# EAGLE design osc (EAGLE 5.11)

## Sheet 1 of 2
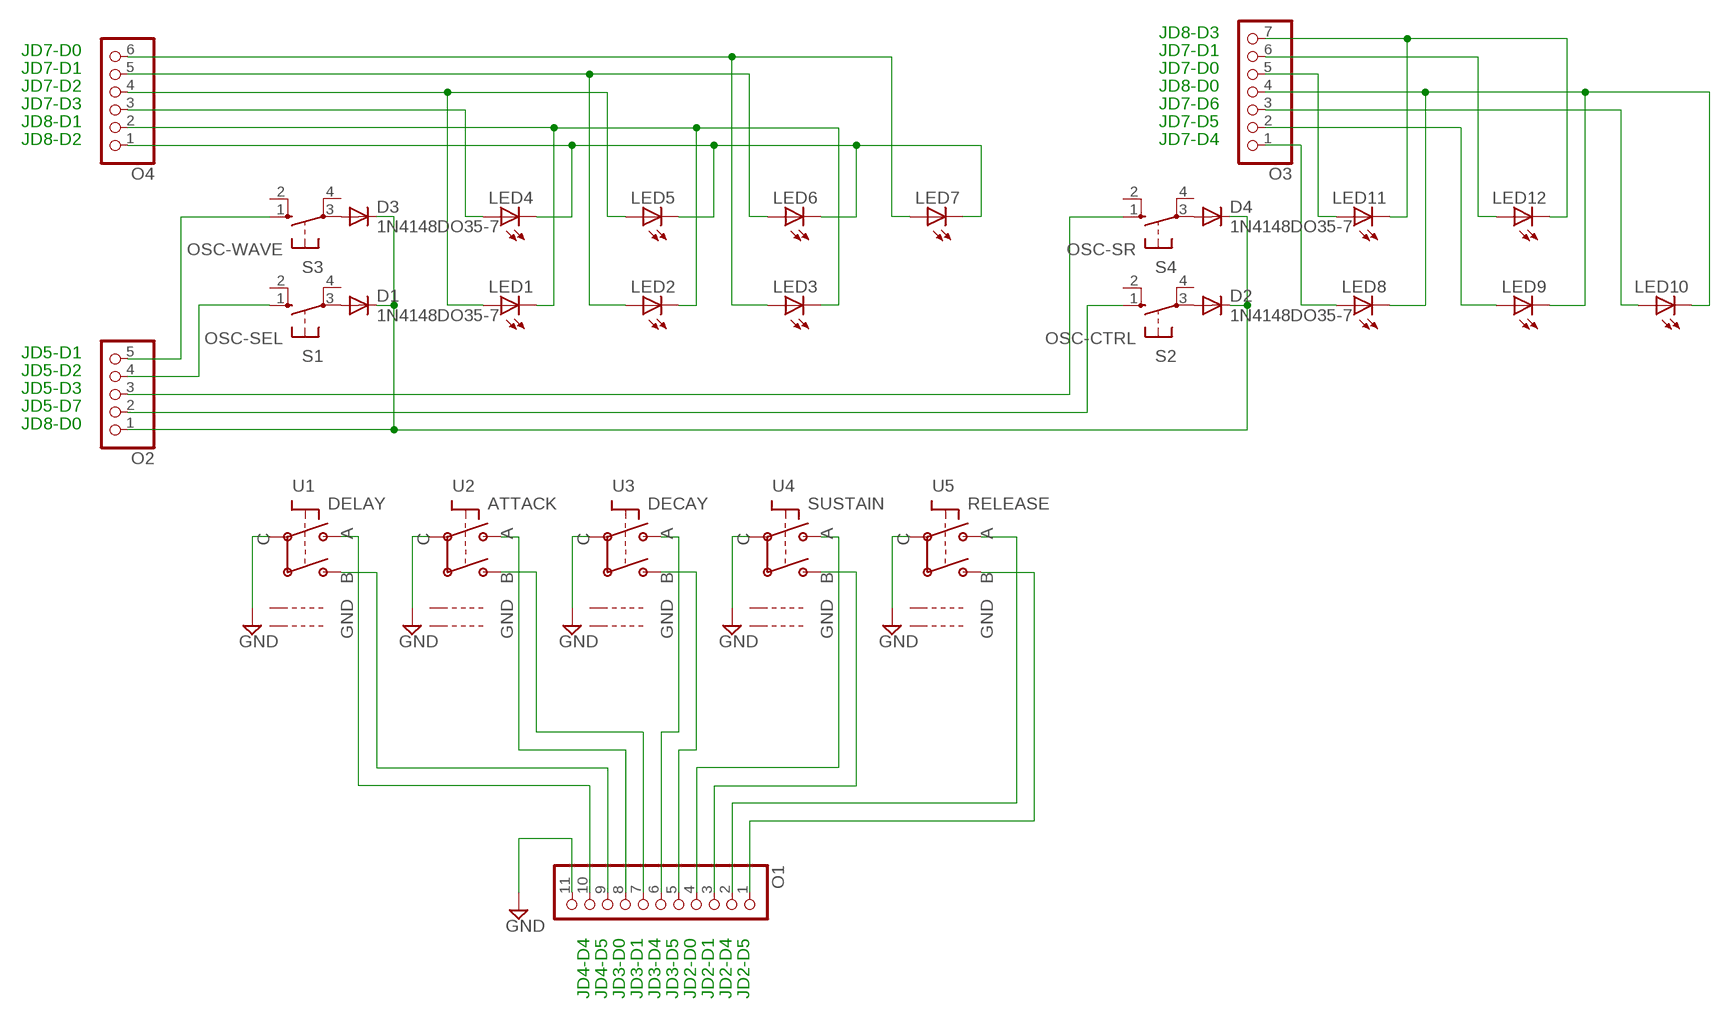
[diagram p0: schematic, sheet 1]

### Parts
D1  1N4148DO35-7  [DO35-7]
D2  1N4148DO35-7  [DO35-7]
D3  1N4148DO35-7  [DO35-7]
D4  1N4148DO35-7  [DO35-7]
LED1  LED3MM  [LED3MM]
LED2  LED3MM  [LED3MM]
LED3  LED3MM  [LED3MM]
LED4  LED3MM  [LED3MM]
LED5  LED3MM  [LED3MM]
LED6  LED3MM  [LED3MM]
LED7  LED3MM  [LED3MM]
LED8  LED3MM  [LED3MM]
LED9  LED3MM  [LED3MM]
LED10  LED3MM  [LED3MM]
LED11  LED3MM  [LED3MM]
LED12  LED3MM  [LED3MM]
O1  PINHD-1X11  [1X11]
O2  PINHD-1X5  [1X05]
O3  PINHD-1X7  [1X07]
O4  PINHD-1X6  [1X06]
S1  OSC-SEL  10-XX  [B3F-10XX]
S2  OSC-CTRL  10-XX  [B3F-10XX]
S3  OSC-WAVE  10-XX  [B3F-10XX]
S4  OSC-SR  10-XX  [B3F-10XX]
U1  DELAY  ENC_ALPS_STEC16  [STEC16]
U2  ATTACK  ENC_ALPS_STEC16  [STEC16]
U3  DECAY  ENC_ALPS_STEC16  [STEC16]
U4  SUSTAIN  ENC_ALPS_STEC16  [STEC16]
U5  RELEASE  ENC_ALPS_STEC16  [STEC16]

### Nets
GND: O1.11 U1.P$C U2.P$C U3.P$C U4.P$C U5.P$C
N$1: O1.10 U1.P$A
N$2: O1.9 U1.P$B
N$3: D3.A S3.3(P)
N$4: O1.8 U2.P$A
N$5: O1.7 U2.P$B
N$6: O1.6 U3.P$A
N$7: O1.5 U3.P$B
N$8: LED11.A O3.5
N$9: O1.4 U4.P$A
N$10: O1.3 U4.P$B
N$11: D1.A S1.3(P)
N$12: D2.A S2.3(P)
N$13: O2.4 S1.1(S)
N$14: O1.2 U5.P$A
N$15: O2.2 S2.1(S)
N$16: D1.C D2.C D3.C D4.C O2.1
N$17: O1.1 U5.P$B
N$18: D4.A S4.3(P)
N$19: LED12.A O3.6
N$20: LED11.K(C) LED12.K(C) O3.7
N$21: LED8.A O3.1
N$22: LED9.A O3.2
N$23: LED10.A O3.3
N$24: O2.5 S3.1(S)
N$25: LED8.K(C) LED9.K(C) LED10.K(C) O3.4
N$26: O2.3 S4.1(S)
N$27: LED1.K(C) LED2.K(C) LED3.K(C) O4.2
N$28: LED2.A LED6.A O4.5
N$30: LED4.K(C) LED5.K(C) LED6.K(C) LED7.K(C) O4.1
N$35: LED4.A O4.3
N$37: LED3.A LED7.A O4.6
N$38: LED1.A LED5.A O4.4
Unconnected: S1.2(S1) S1.4(P1) S2.2(S1) S2.4(P1) S3.2(S1) S3.4(P1) S4.2(S1) S4.4(P1) U1.P$GND1 U1.P$GND2 U2.P$GND1 U2.P$GND2 U3.P$GND1 U3.P$GND2 U4.P$GND1 U4.P$GND2 U5.P$GND1 U5.P$GND2

### Notes on the sheet
- JD8-D3
- JD7-D0 | JD7-D1
- JD7-D1 | JD7-D0
- JD7-D2 | JD8-D0
- JD7-D3 | JD7-D6
- JD8-D1 | JD7-D5
- JD8-D2 | JD7-D4
- JD5-D1
- JD5-D2
- JD5-D3
- JD5-D7
- JD8-D0
- JD4-D4 | JD4-D5 | JD3-D0 | JD3-D1 | JD3-D4 | JD3-D5 | JD2-D0 | JD2-D1 | JD2-D4 | JD2-D5

## Sheet 2 of 2

## Library data of the parts
D1-D4 = diode:1N4148: DIODE high speed (Philips)
LED1-LED12 = led:LED: LED OSRAM: - CHIPLED LG R971, LG N971, LY N971, LG Q971, LY Q971, LO R971, LY R971 LH N974, LH R974 LS Q976, LO Q976, LY Q976 LO Q996 - Hyper CHIPLED LW Q18S LB Q993, LB Q99A, LB R99A - SideLED LS A670, LO A670, LY A670, LG A670, LP A670 LB A673, LV A673, LT A673, LW A673 LH A674 LY A675 LS A676, LA A676, LO A676, LY A676, LW A676 LS A679, LY A679, LG A679 - Hyper Micro SIDELED® LS Y876, LA Y876, LO Y876, LY Y876 LT Y87S - SmartLED LW L88C, LW L88S LB L89C, LB L89S, LG L890 LS L89K, LO L89K, LY L89K LS L896, LA L896, LO L896, LY L896 - TOPLED LS T670, LO T670, LY T670, LG T670, LP T670 LSG T670, LSP T670, LSY T670, LOP T670, LYG T670 LG T671, LOG T671, LSG T671 LB T673, LV T673, LT T673, LW T673 LH T674 LS T676, LA T676, LO T676, LY T676, LB T676, LH T676, LSB T676, LW T676 LB T67C, LV T67C, LT T67C, LS T67K, LO T67K, LY T67K, LW E67C LS E67B, LA E67B, LO E67B, LY E67B, LB E67C, LV E67C, LT E67C LW T67C LS T679, LY T679, LG T679 LS T770, LO T770, LY T770, LG T770, LP T770 LB T773, LV T773, LT T773, LW T773 LH T774 LS E675, LA E675, LY E675, LS T675 LS T776, LA T776, LO T776, LY T776, LB T776 LHGB T686 LT T68C, LB T68C - Hyper Mini TOPLED® LB M676 - Mini TOPLED Santana® LG M470 LS M47K, LO M47K, LY M47K Source: http://www.osram.convergy.de LUXEON: - LUMILED® LXK2-PW12-R00, LXK2-PW12-S00, LXK2-PW14-U00, LXK2-PW14-V00 LXK2-PM12-R00, LXK2-PM12-S00, LXK2-PM14-U00 LXK2-PE12-Q00, LXK2-PE12-R00, LXK2-PE12-S00, LXK2-PE14-T00, LXK2-PE14-U00 LXK2-PB12-K00, LXK2-PB12-L00, LXK2-PB12-M00, LXK2-PB14-N00, LXK2-PB14-P00, LXK2-PB14-Q00 LXK2-PR12-L00, LXK2-PR12-M00, LXK2-PR14-Q00, LXK2-PR14-R00 LXK2-PD12-Q00, LXK2-PD12-R00, LXK2-PD12-S00 LXK2-PH12-R00, LXK2-PH12-S00 LXK2-PL12-P00, LXK2-PL12-Q00, LXK2-PL12-R00 Source: www.luxeon.com KINGBRIGHT: KA-3528ASYC Source: www.kingbright.com
O1 = pinhead:PINHD-1X11: PIN HEADER
O2 = pinhead:PINHD-1X5: PIN HEADER
O3 = pinhead:PINHD-1X7: PIN HEADER
O4 = pinhead:PINHD-1X6: PIN HEADER
S1-S4 = switch-omron:10-XX: OMRON SWITCH; MPN: B3F-1000; OC_FARNELL: 176432; OC_NEWARK: 36M3542
U1-U5 = encoder:ENC

## Board
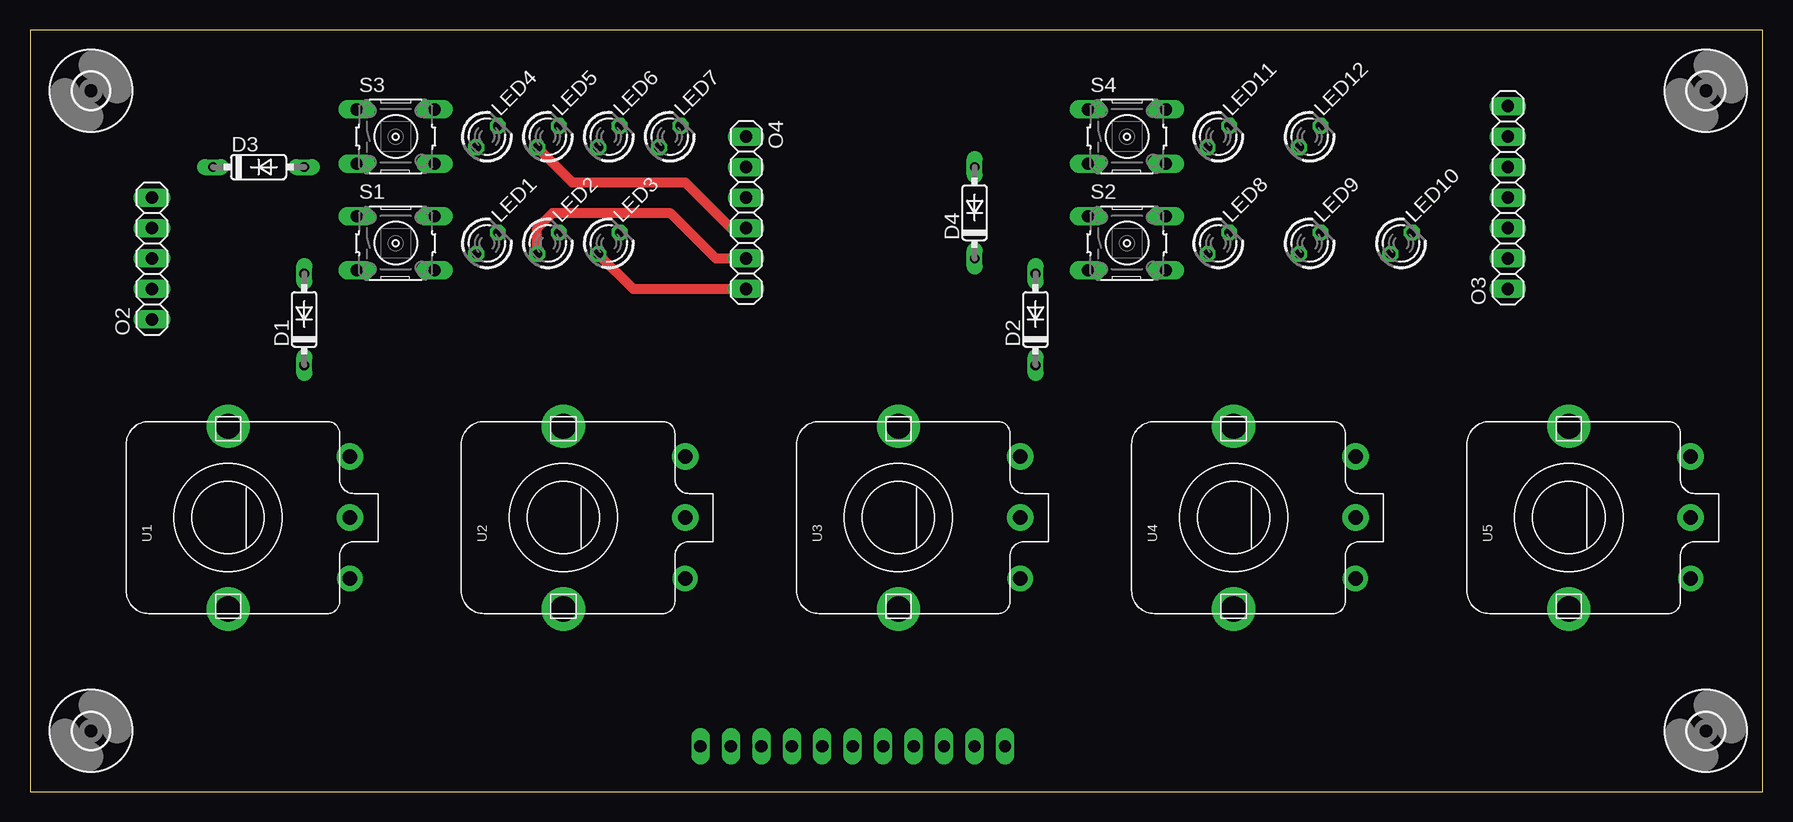
[diagram p1: board, top side]
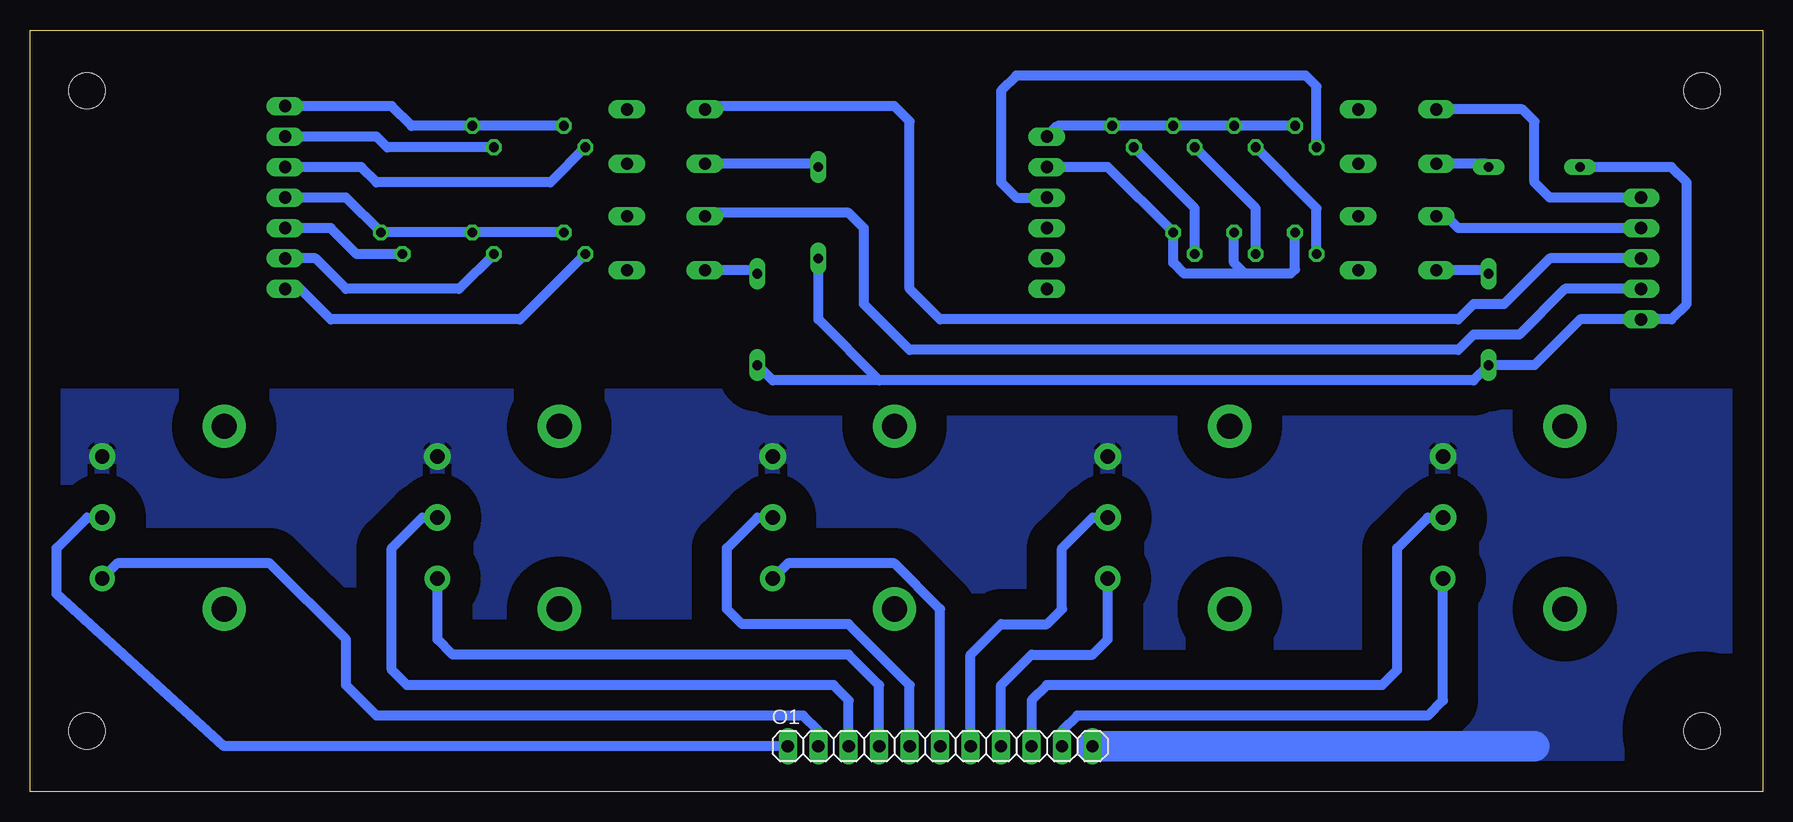
[diagram p2: board, bottom side, seen from below]

Size 144.45 x 63.49 mm. Coordinates in mm from the lower left corner, seen from the top.
Outline: 0,0 144.45,0 144.45,63.49 0,63.49 0,0
Copper layers (1*16): Top 0.035mm / dielectric 1.5mm / Bottom 0.035mm
Design rules "default": minimum track width 10mil, minimum drill 24mil, track to track 8mil, track to pad 8mil, pad to pad 8mil, via to via 8mil, smd to smd 8mil, copper to edge 40mil, drill to drill 8mil, minimum pad ring 10mil, minimum via ring 8mil, stop-mask expansion 4mil, vias tented up to drill 0mil, thermal gap 10mil

### Footprints (pad centres in the part's own frame; a part is rotated, then mirrored left to right if it is on the bottom)
DO35-7 = drill 0.813 long: A 3.81,0; C -3.81,0
LED3MM = drill 0.813 octagon: A -1.27,0; K 1.27,0
1X11 = drill 1.016 long: 1 -12.7,0; 2 -10.16,0; 3 -7.62,0; 4 -5.08,0; 5 -2.54,0; 6 0,0; 7 2.54,0; 8 5.08,0; 9 7.62,0; 10 10.16,0; 11 12.7,0
1X05 = drill 1.016 long: 1 -5.08,0; 2 -2.54,0; 3 0,0; 4 2.54,0; 5 5.08,0
1X07 = drill 1.016 long: 1 -7.62,0; 2 -5.08,0; 3 -2.54,0; 4 0,0; 5 2.54,0; 6 5.08,0; 7 7.62,0
1X06 = drill 1.016 long: 1 -6.35,0; 2 -3.81,0; 3 -1.27,0; 4 1.27,0; 5 3.81,0; 6 6.35,0
B3F-10XX = drill 1.016 long: 1 -3.251,2.261; 2 3.251,2.261; 3 -3.251,-2.261; 4 3.251,-2.261
STEC16 = drill 1.2 pad 2.1 round: P$A -5.08,-10.16 | drill 1.2 pad 2.2 round: P$B 0,-10.16; P$C 5.08,-10.16 | drill 2.1 pad 3.6 round: P$GND1 -7.62,0; P$GND2 7.62,0
3,0 = hole 3: 0,0

### Placement (x,y rotation side)
D1  22.86,39.37 90 top
D2  83.82,39.37 90 top
D3  19.05,52.07 0 top
D4  78.74,48.26 90 top
LED1  38.1,45.72 45 top
LED2  43.18,45.72 45 top
LED3  48.26,45.72 45 top
LED4  38.1,54.61 45 top
LED5  43.18,54.61 45 top
LED6  48.26,54.61 45 top
LED7  53.34,54.61 45 top
LED8  99.06,45.72 45 top
LED9  106.68,45.72 45 top
LED10  114.3,45.72 45 top
LED11  99.06,54.61 45 top
LED12  106.68,54.61 45 top
O1  68.58,3.81 0 bottom
O2  10.16,44.45 90 top
O3  123.19,49.53 90 top
O4  59.69,48.26 270 top
S1  30.48,45.72 0 top
S2  91.44,45.72 0 top
S3  30.48,54.61 0 top
S4  91.44,54.61 0 top
U1  16.51,22.86 90 top
U2  44.45,22.86 90 top
U3  72.39,22.86 90 top
U4  100.33,22.86 90 top
U5  128.27,22.86 90 top
U$1  [3,0]  5.08,5.08 0 top
U$2  [3,0]  139.7,5.08 0 top
U$3  [3,0]  5.08,58.42 0 top
U$4  [3,0]  139.7,58.42 0 top

### Tracks (layer width: path | path; a pad name or v marks a point on that pad's centre or on a via)
GND
  Bottom 2.54: 19.05,3.81 O1.11
  pour Bottom (isolate 2.54): -1.27,33.02 -1.27,-1.27 146.05,-1.27 146.05,33.02
N$1
  Bottom 0.813: U1.P$A 26.67,7.62 27.94,6.35 57.15,6.35 58.42,5.08 O1.10
N$2
  Bottom 0.813: U1.P$B 27.94,22.86 30.48,20.32 30.48,10.16 31.75,8.89 59.69,8.89 60.96,7.62 O1.9
N$3
  Bottom 0.813: S3.3 23.14,52.35 D3.A
N$4
  Bottom 0.813: O1.8 63.5,8.89 60.96,11.43 55.88,11.43 54.61,12.7 U2.P$A
N$5
  Bottom 0.813: U2.P$B 55.88,22.86 58.42,20.32 58.42,15.24 59.69,13.97 63.5,13.97 66.04,11.43 O1.7
N$6
  Bottom 0.813: O1.6 68.58,15.24 72.39,19.05 81.28,19.05 U3.P$A
N$7
  Bottom 0.813: U3.P$B 83.82,22.86 86.36,20.32 86.36,15.24 85.09,13.97 76.2,13.97 71.12,8.89 O1.5
N$8
  Bottom 0.813: O3.5 116.84,52.07 115.57,50.8 101.07,50.8 LED11.A
N$9
  Bottom 0.813: U4.P$A 110.49,12.7 109.22,11.43 76.2,11.43 73.66,8.89 O1.4
N$10
  Bottom 0.813: U4.P$B 111.76,22.86 114.3,20.32 114.3,10.16 113.03,8.89 77.47,8.89 76.2,7.62 O1.3
N$11
  Bottom 0.813: S1.3 23.14,43.46 D1.A
N$12
  Bottom 0.813: S2.3 84.1,43.46 D2.A
N$13
  Bottom 0.813: S1.1 26.39,47.98 25.4,46.99 O2.4
N$14
  Bottom 0.813: U5.P$A 137.16,19.05 124.46,19.05 118.11,12.7 118.11,8.89 115.57,6.35 80.01,6.35 78.74,5.08 O1.2
N$15
  Bottom 0.813: O2.2 16.51,41.91 20.32,38.1 24.13,38.1 25.4,36.83 71.12,36.83 74.93,40.64 74.93,46.99 76.2,48.26 87.91,48.26 S2.1
N$16
  Bottom 0.813: D4.C 78.74,39.37 73.66,34.29 | D3.C 7.62,52.07 6.35,50.8 6.35,40.64 7.62,39.37 O2.1 15.24,39.37 19.05,35.56 D1.C 24.13,34.29 73.66,34.29 | D2.C 82.55,34.29 73.66,34.29
N$17
  Bottom 0.813: U5.P$B 139.7,22.86 142.24,20.32 142.24,16.51 128.27,3.81 O1.1
N$18
  Bottom 0.813: S4.3 79.02,52.35 D4.A
N$19
  Bottom 0.813: LED12.A 114.67,53.71 115.57,54.61 O3.6
N$20
  Bottom 0.813: LED11.K LED12.K 112.66,55.51 114.3,57.15 O3.7
N$21
  Bottom 0.813: LED8.A 103.61,39.37 119.38,39.37 121.92,41.91 O3.1
N$22
  Bottom 0.813: LED9.A 108.69,41.91 118.11,41.91 120.65,44.45 O3.2
N$23
  Bottom 0.813: LED10.A 117.21,44.82 119.38,46.99 O3.3
N$24
  Bottom 0.813: O2.5 17.78,49.53 19.05,50.8 19.05,55.88 20.04,56.87 S3.1
N$25
  Bottom 0.813: LED8.K LED9.K LED10.K 118.11,49.53 O3.4
N$26
  Bottom 0.813: O2.3 17.78,44.45 21.59,40.64 24.13,40.64 25.4,39.37 68.58,39.37 71.12,41.91 71.12,55.88 72.39,57.15 87.91,57.15 S4.1
N$27
  Bottom 0.813: LED1.K 39,43.55 39.37,43.18 43.18,43.18 | LED2.K 44.08,44.08 43.18,43.18 | 43.18,43.18 48.26,43.18 49.16,44.08 LED3.K 54.61,52.07 O4.2
N$28
  Top 0.813: LED2.A 42.28,46.99 43.55,48.26 53.34,48.26 57.15,44.45 O4.5
  Bottom 0.813: LED2.A 42.28,48.63 LED6.A
N$30
  Bottom 0.813: LED4.K LED5.K LED6.K LED7.K 58.79,55.51 O4.1
N$35
  Bottom 0.813: LED4.A 37.2,58.79 38.1,59.69 62.23,59.69 63.5,58.42 63.5,50.8 62.23,49.53 O4.3
N$37
  Top 0.813: 47.73,44.45 LED3.A 50.27,41.91 O4.6
  Bottom 0.813: LED3.A 47.36,48.63 LED7.A
N$38
  Top 0.813: O4.4 58.42,46.99 54.61,50.8 45.19,50.8 LED5.A
  Bottom 0.813: LED1.A 37.2,48.63 LED5.A